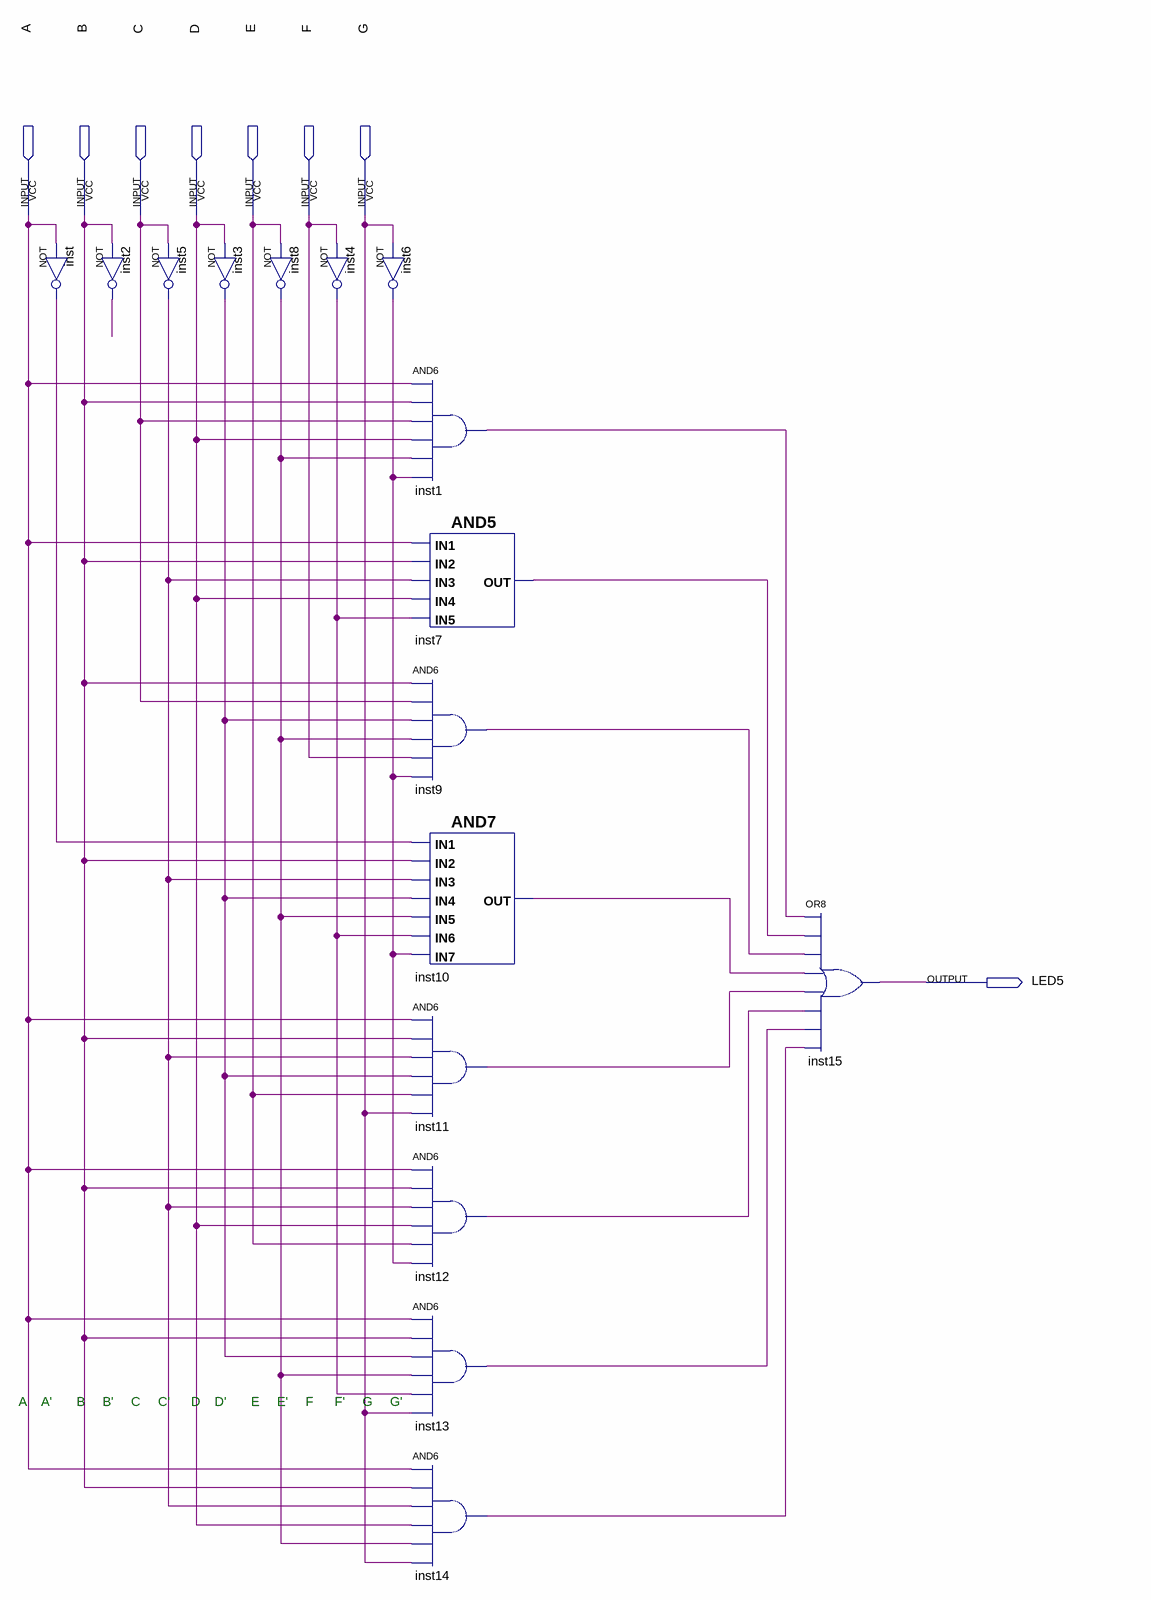
[diagram p0: schematic sheet]
// Quartus schematic LED5LINHA7MATRIZ.bdf as structural Verilog: 16 symbols, 8 pins
module LED5LINHA7MATRIZ (
  input  A,
  input  B,
  input  C,
  input  D,
  input  E,
  input  F,
  input  G,
  output LED5
);

  wire inst1_out, inst2_out, inst3_out, inst4_out, inst5_out, inst6_out, inst7_out, inst8_out, inst9_out,
       inst10_out, inst11_out, inst12_out, inst13_out, inst14_out, inst_out;

  not inst (inst_out, A);
  not inst2 (inst2_out, B);
  not inst5 (inst5_out, C);
  not inst3 (inst3_out, D);
  not inst8 (inst8_out, E);
  not inst4 (inst4_out, F);
  not inst6 (inst6_out, G);
  and inst1 (inst1_out, A, B, C, D, inst8_out, inst6_out);
  and inst7 (inst7_out, A, B, inst5_out, D, inst4_out);
  and inst9 (inst9_out, B, C, inst3_out, inst8_out, F, inst6_out);
  and inst10 (inst10_out, inst_out, B, inst5_out, inst3_out, inst8_out, inst4_out, inst6_out);
  and inst11 (inst11_out, A, B, inst5_out, inst3_out, E, G);
  and inst12 (inst12_out, A, B, inst5_out, D, E, inst6_out);
  and inst13 (inst13_out, A, B, inst3_out, inst8_out, inst4_out, G);
  and inst14 (inst14_out, A, B, inst5_out, D, inst8_out, G);
  or inst15 (LED5, inst1_out, inst7_out, inst9_out, inst10_out, inst11_out, inst12_out, inst13_out, inst14_out);

  // Notes on the sheet:
  //   A    A'       B     B'     C     C'      D    D'       E     E'     F      F'     G     G'
endmodule
